# Altium schematic sheet Wireless.SchDoc: ESP32 Wireless module
size A4; Organization: Use Organization_Name in ProjParam; Address1: Eliot Ferragni; Address2: STI-MOBOTS; Address3: EPFL; Address4: CH-1015 LAUSANNE; DocumentNumber: 8; Revision: A; SheetNumber: 8; SheetTotal: 11; ApprovedBy: Init ApprovedBy in DocParam; CheckedBy: Init CheckedBy in DocParam; Author: Init Author in DocParam; CompanyName: Init CompanyName in DocParam; DrawnBy: Init DrawBy in DocParam; Engineer: Init Engineer in DocParam; Title2: WiFi + BT4.2/BLE + Xtensa dual core 600 DMips; DocumentName: Init DocumentName in DocParam; ProjectName: Init ProjectName in DocParam
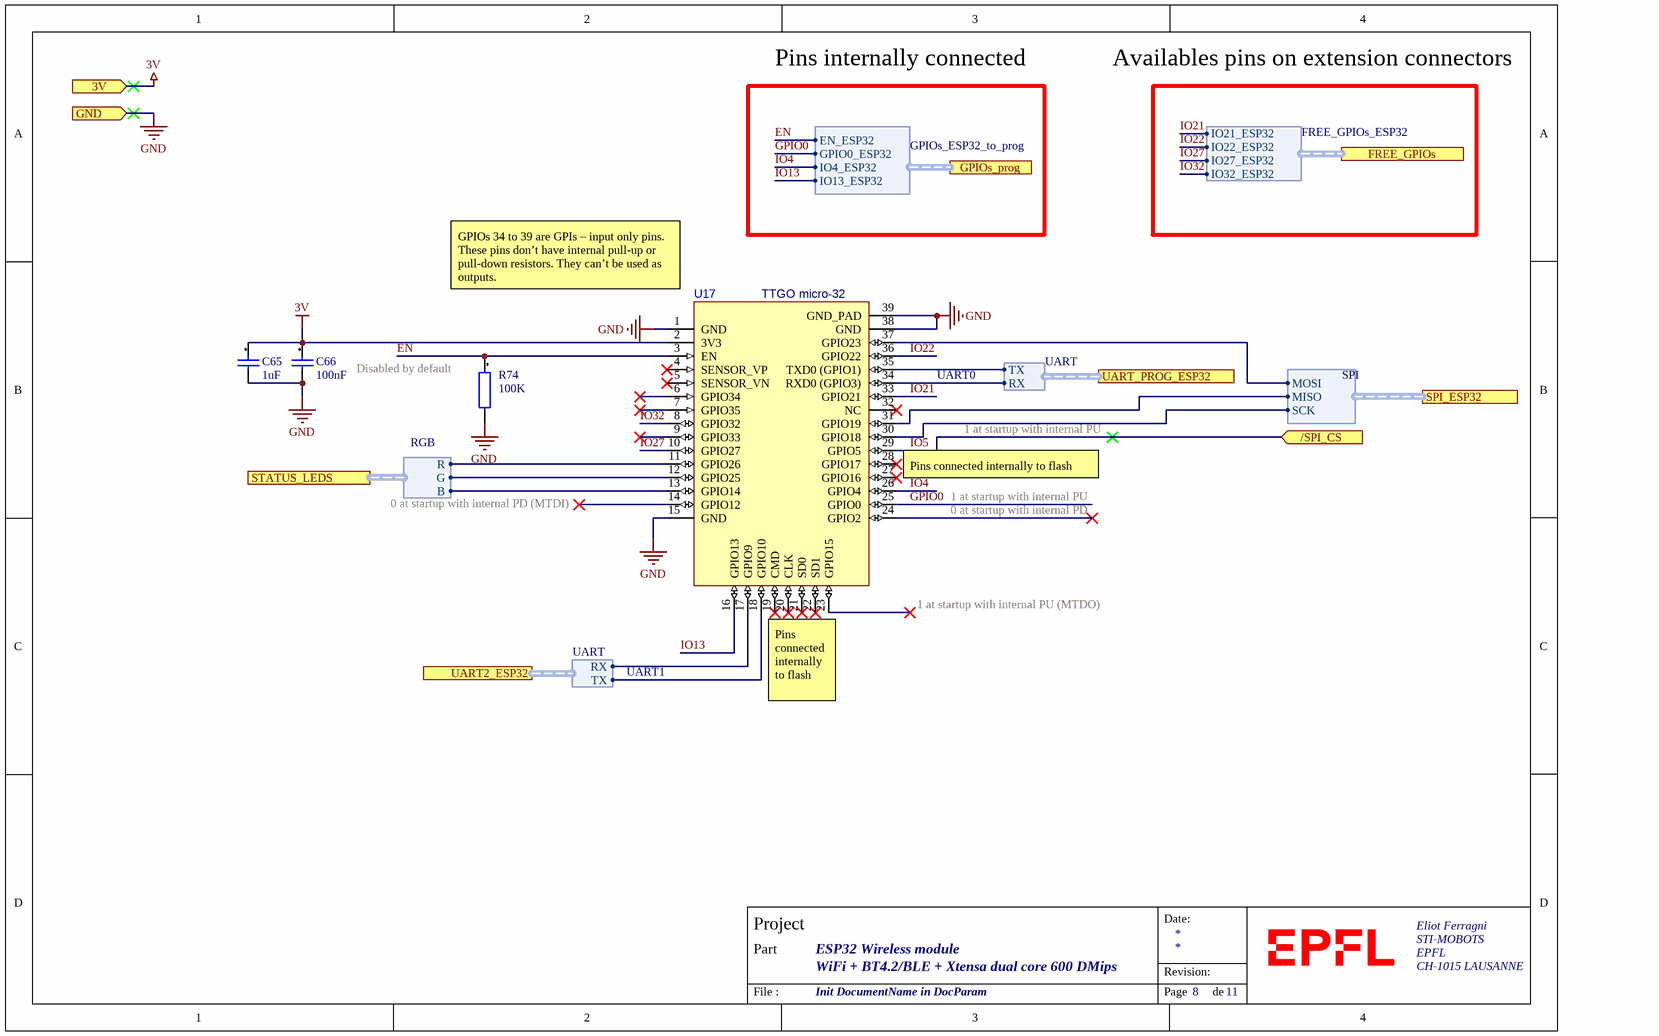
[diagram p0: Wireless.SchDoc]

## Parts
C65  1uF  [CAPC0201(0603)33_L]
C66  100nF  [CAPC0201(0603)33_L]
R74  100K  [RESC0201(0603)_L]
U17  PART NUMBER: TTGO micro-32  [TTGO Micro-32 (ESP32)]  (hidden comment: TTGO micro-32 (ESP32))

## Ports
3V (in), /SPI_CS (in), FREE_GPIOs (harness FREE_GPIOs_ESP32), GND (in), GPIOs_prog (harness GPIOs_ESP32_to_prog), SPI_ESP32 (harness SPI), STATUS_LEDS (harness RGB), UART2_ESP32 (harness UART), UART_PROG_ESP32 (harness UART)

## Harnesses
SPI: MISO, MOSI, SCK
UART: RX, TX
RGB: R, G, B
FREE_GPIOs_ESP32: IO22_ESP32, IO21_ESP32, IO27_ESP32, IO32_ESP32
GPIOs_ESP32_to_prog: IO4_ESP32, IO13_ESP32, GPIO0_ESP32, EN_ESP32

## Nets
3V: C65.1 C66.1 U17.2(3V3) ; port 3V
GND: C65.2 C66.2 R74.2 U17.1(GND) U17.15(GND) U17.38(GND) U17.39(GND_PAD) ; port GND
EN: R74.1 U17.3(EN) ; port GPIOs_prog.EN_ESP32
GPIO0: U17.25(GPIO0) ; port GPIOs_prog.GPIO0_ESP32
IO4: U17.26(GPIO4) ; port GPIOs_prog.IO4_ESP32
IO5: U17.29(GPIO5) ; port /SPI_CS
IO13: U17.16(GPIO13) ; port GPIOs_prog.IO13_ESP32
IO21: U17.33(GPIO21) ; port FREE_GPIOs.IO21_ESP32
IO22: U17.36(GPIO22) ; port FREE_GPIOs.IO22_ESP32
IO27: U17.10(GPIO27) ; port FREE_GPIOs.IO27_ESP32
IO32: U17.8(GPIO32) ; port FREE_GPIOs.IO32_ESP32
NetU17_11: U17.11(GPIO26) ; port STATUS_LEDS.R
NetU17_12: U17.12(GPIO25) ; port STATUS_LEDS.G
NetU17_13: U17.13(GPIO14) ; port STATUS_LEDS.B
NetU17_17: U17.17(GPIO9) ; port UART2_ESP32.RX
NetU17_18: U17.18(GPIO10) ; port UART2_ESP32.TX
NetU17_30: U17.30(GPIO18) ; port SPI_ESP32.SCK
NetU17_31: U17.31(GPIO19) ; port SPI_ESP32.MISO
NetU17_34: U17.34(RXD0_(GPIO3)) ; port UART_PROG_ESP32.RX
NetU17_35: U17.35(TXD0_(GPIO1)) ; port UART_PROG_ESP32.TX
NetU17_37: U17.37(GPIO23) ; port SPI_ESP32.MOSI

Not connected (* = marked no-connect by the designer): U17 4(SENSOR_VP)* 5(SENSOR_VN)* 6(GPIO34)* 7(GPIO35)* 9(GPIO33)* 14(GPIO12)* 19(CMD)* 20(CLK)* 21(SD0)* 22(SD1)* 23(GPIO15)* 24(GPIO2)* 27(GPIO16)* 28(GPIO17)* 32(NC)*

## Notes on the sheet
- Pins internally connected
- Availables pins on extension connectors
- (near U17) GPIOs 34 to 39 are GPIs – input only pins. These pins don’t have internal pull-up or pull-down resistors. They can’t be used as outputs.
- (near R74) Disabled by default
- UART0
- 1 at startup with internal PU
- 0 at startup with internal PD (MTDI)
- (near U17) Pins connected internally to flash
- 0 at startup with internal PD
- (near U17) 1 at startup with internal PU (MTDO)
- UART1
- Date:
- Project
- Part
- Revision:
- File :
- Page
- de

## Library data of the parts
C65 C66 = TBD Capacitor[[/\]]0201[[/\]]1: Capacitor 0201; Preference: 1; Currentie: CHF; Type: SMD; Note: To buy by assembler; Size: 0201; Footprint Acort: 0201; ROHS: True; DateLastUpdate: 2018-10-19 / 8:59:52 AM; Manufacturer: -; Manufacturer part number: -; Package / Case: Capacitor 0201
R74 = TBD[[/\]]0201[[/\]]1: Resistor 0201; Preference: 1; Currentie: CHF; Note: To buy by assembler; Size: 0201; Footprint Acort: 0201; ROHS: True; DateLastUpdate: 2018-10-19 / 9:06:49 AM; Type: SMD; Manufacturer: -; Manufacturer part number: -; Package / Case: Resistor 0201
U17 = TTGO micro-32 (ESP32): Wi-Fi BT BLE MCU Module; MANUFACTURER: LilyLGo; ESPRESSIF CHIP: esp32-pico-d4; Note: Provided by Customer; Type: SMD; Manufacturer part number: TTGO micro-32 (ESP32); Package / Case: SMD module